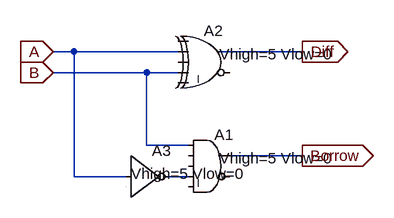
[diagram p0: schematic halfSubtractor.asc]
halfSubtractor.asc, the LTspice schematic file:
Version 4
SHEET 1 880 680
WIRE 16 16 -16 16
WIRE 176 16 16 16
WIRE 368 16 240 16
WIRE 128 48 -16 48
WIRE 176 48 128 48
WIRE 128 160 128 48
WIRE 192 160 128 160
WIRE 368 176 256 176
WIRE 16 208 16 16
WIRE 96 208 16 208
WIRE 192 208 160 208
FLAG -16 16 A
IOPIN -16 16 In
FLAG -16 48 B
IOPIN -16 48 In
FLAG 368 16 Diff
IOPIN 368 16 Out
FLAG 368 176 Borrow
IOPIN 368 176 Out
SYMBOL Digital\\and 224 128 R0
WINDOW 3 16 52 Left 2
SYMATTR InstName A1
SYMATTR Value Vhigh=5 Vlow=0
SYMBOL Digital\\xor 224 -32 R0
WINDOW 3 16 52 Left 2
SYMATTR InstName A2
SYMATTR Value Vhigh=5 Vlow=0
SYMBOL Digital\\inv 96 144 R0
WINDOW 3 8 60 Left 2
SYMATTR InstName A3
SYMATTR Value Vhigh=5 Vlow=0

The netlist it stands for:
* halfSubtractor.asc
A1 B 0 0 N001 0 0 Borrow 0 AND Vhigh=5 Vlow=0
A2 0 A 0 B 0 0 Diff 0 XOR Vhigh=5 Vlow=0
A3 A 0 0 0 0 N001 0 0 BUF Vhigh=5 Vlow=0
.backanno
.end